# EAGLE schematic FDL-1 CTRL v1.0 (EAGLE 7.5.0)
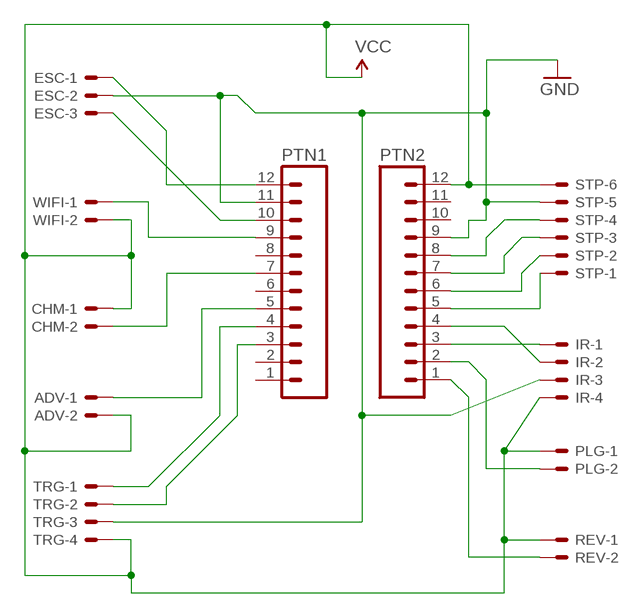
[diagram p0: schematic, sheet 1]

## Parts
ADV  JST-XH-02-PIN-LONG-PAD  [JST-XH-02-PACKAGE-LONG-PAD]
CHM  JST-XH-02-PIN-LONG-PAD  [JST-XH-02-PACKAGE-LONG-PAD]
ESC  JST-XH-03-PIN-LONG-PAD  [JST-XH-03-PACKAGE-LONG-PAD]
IR  JST-XH-04-PIN-LONG-PAD  [JST-XH-04-PACKAGE-LONG-PAD]
PLG  JST-XH-02-PIN-LONG-PAD  [JST-XH-02-PACKAGE-LONG-PAD]
PTN1  M12PTH  [1X12]
PTN2  M12PTH  [1X12]
REV  JST-XH-02-PIN-LONG-PAD  [JST-XH-02-PACKAGE-LONG-PAD]
STP  JST-XH-06-PIN-LONG-PAD  [JST-XH-06-PACKAGE-LONG-PAD]
TRG  JST-XH-04-PIN-LONG-PAD  [JST-XH-04-PACKAGE-LONG-PAD]
WIFI  JST-XH-02-PIN-LONG-PAD  [JST-XH-02-PACKAGE-LONG-PAD]

## Nets
GND: ESC.2 IR.3 PTN1.11 PTN2.9 STP.5 TRG.3
N$1: IR.2 PTN2.4
N$2: ESC.1 PTN1.12
N$3: PTN1.3 TRG.2
N$4: ESC.3 PTN1.10
N$6: PTN1.9 WIFI.1
N$7: IR.1 PTN2.3
N$8: ADV.1 PTN1.5
N$10: CHM.2 PTN1.7
N$11: PLG.2 PTN2.2
N$12: PTN2.1 REV.2
N$14: PTN2.8 STP.4
N$15: PTN2.7 STP.3
N$16: PTN2.6 STP.2
N$17: PTN2.5 STP.1
N$19: PTN1.4 TRG.1
VCC: ADV.2 CHM.1 IR.4 PLG.1 PTN2.12 REV.1 STP.6 TRG.4 WIFI.2
Unconnected: PTN1.1 PTN1.2 PTN1.6 PTN1.8 PTN2.10 PTN2.11

## Library data of the parts
ADV CHM PLG REV WIFI = Rembrandt Electronics - JST XH Connectors v1-0:JST-XH-02-PIN: JST XH Connector 2 Pin Wire to board connector. Pitch: 2,54 mm, (0.100") Number of pins: 2 Created by Rembrandt Electronics www.rembrandtelectronics.com
ESC = Rembrandt Electronics - JST XH Connectors v1-0:JST-XH-03-PIN: JST XH Connector 2 Pin Wire to board connector. Pitch: 2,54 mm, (0.100") Number of pins: 3 Created by Rembrandt Electronics www.rembrandtelectronics.com
IR TRG = Rembrandt Electronics - JST XH Connectors v1-0:JST-XH-04-PIN: JST XH Connector 2 Pin Wire to board connector. Pitch: 2,54 mm, (0.100") Number of pins: 4 Created by Rembrandt Electronics www.rembrandtelectronics.com
PTN1 PTN2 = SparkFun-Connectors:M12: Header 12 Standard 12-pin 0.1" header. Use with straight break away headers (SKU : PRT-00116), right angle break away headers (PRT-00553), swiss pins (PRT-00743), machine pins (PRT-00117), and female headers (PRT-00115).
STP = Rembrandt Electronics - JST XH Connectors v1-0:JST-XH-06-PIN: JST XH Connector 2 Pin Wire to board connector. Pitch: 2,54 mm, (0.100") Number of pins: 6 Created by Rembrandt Electronics www.rembrandtelectronics.com